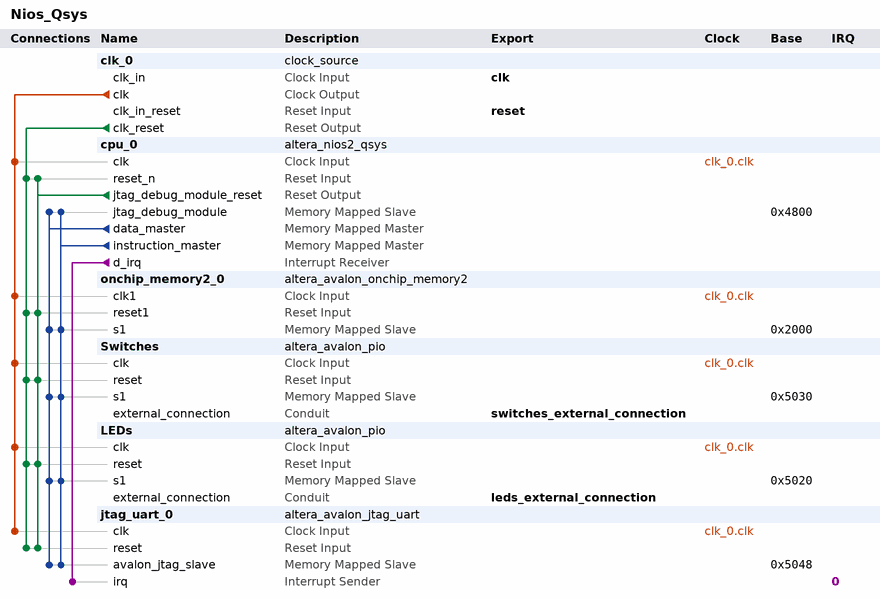
[diagram p0: system contents]
# Platform Designer (Qsys) system Nios_Qsys, Cyclone II EP2C35F672C6
# Parameters at their usual value, and those the tool derives, are not listed.
package require -exact qsys 13.0.1.99.2
create_system Nios_Qsys
set_project_property DEVICE_FAMILY {Cyclone II}
set_project_property DEVICE EP2C35F672C6

add_instance clk_0 clock_source 13.0
set_instance_parameter_value clk_0 clockFrequency 50000000

add_instance cpu_0 altera_nios2_qsys 13.0
set_instance_parameter_value cpu_0 resetSlave onchip_memory2_0.s1
set_instance_parameter_value cpu_0 mmu_TLBMissExcSlave None
set_instance_parameter_value cpu_0 exceptionSlave onchip_memory2_0.s1
set_instance_parameter_value cpu_0 breakSlave cpu_0.jtag_debug_module
set_instance_parameter_value cpu_0 impl Tiny
set_instance_parameter_value cpu_0 icache_size 4096

add_instance onchip_memory2_0 altera_avalon_onchip_memory2 13.0.1.99.2
set_instance_parameter_value onchip_memory2_0 dataWidth 32
set_instance_parameter_value onchip_memory2_0 dualPort false
set_instance_parameter_value onchip_memory2_0 initMemContent true
set_instance_parameter_value onchip_memory2_0 initializationFileName onchip_mem.hex
set_instance_parameter_value onchip_memory2_0 memorySize 8192

add_instance Switches altera_avalon_pio 13.0.1.99.2
set_instance_parameter_value Switches direction Input
set_instance_parameter_value Switches width 18

add_instance LEDs altera_avalon_pio 13.0.1.99.2
set_instance_parameter_value LEDs direction Output
set_instance_parameter_value LEDs width 18

add_instance jtag_uart_0 altera_avalon_jtag_uart 13.0.1.99.2
set_instance_parameter_value jtag_uart_0 simInteractiveOptions NO_INTERACTIVE_WINDOWS

# connections
add_connection clk_0.clk cpu_0.clk clock
add_connection clk_0.clk jtag_uart_0.clk clock
add_connection clk_0.clk LEDs.clk clock
add_connection clk_0.clk onchip_memory2_0.clk1 clock
add_connection clk_0.clk Switches.clk clock
add_connection clk_0.clk_reset cpu_0.reset_n reset
add_connection clk_0.clk_reset jtag_uart_0.reset reset
add_connection clk_0.clk_reset LEDs.reset reset
add_connection clk_0.clk_reset onchip_memory2_0.reset1 reset
add_connection clk_0.clk_reset Switches.reset reset
add_connection cpu_0.jtag_debug_module_reset cpu_0.reset_n reset
add_connection cpu_0.jtag_debug_module_reset jtag_uart_0.reset reset
add_connection cpu_0.jtag_debug_module_reset LEDs.reset reset
add_connection cpu_0.jtag_debug_module_reset onchip_memory2_0.reset1 reset
add_connection cpu_0.jtag_debug_module_reset Switches.reset reset
add_connection cpu_0.data_master cpu_0.jtag_debug_module avalon
set_connection_parameter_value cpu_0.data_master/cpu_0.jtag_debug_module baseAddress 0x4800
add_connection cpu_0.data_master jtag_uart_0.avalon_jtag_slave avalon
set_connection_parameter_value cpu_0.data_master/jtag_uart_0.avalon_jtag_slave baseAddress 0x5048
add_connection cpu_0.data_master LEDs.s1 avalon
set_connection_parameter_value cpu_0.data_master/LEDs.s1 baseAddress 0x5020
add_connection cpu_0.data_master onchip_memory2_0.s1 avalon
set_connection_parameter_value cpu_0.data_master/onchip_memory2_0.s1 baseAddress 0x2000
add_connection cpu_0.data_master Switches.s1 avalon
set_connection_parameter_value cpu_0.data_master/Switches.s1 baseAddress 0x5030
add_connection cpu_0.instruction_master cpu_0.jtag_debug_module avalon
set_connection_parameter_value cpu_0.instruction_master/cpu_0.jtag_debug_module baseAddress 0x4800
add_connection cpu_0.instruction_master jtag_uart_0.avalon_jtag_slave avalon
set_connection_parameter_value cpu_0.instruction_master/jtag_uart_0.avalon_jtag_slave baseAddress 0x5048
add_connection cpu_0.instruction_master LEDs.s1 avalon
set_connection_parameter_value cpu_0.instruction_master/LEDs.s1 baseAddress 0x5020
add_connection cpu_0.instruction_master onchip_memory2_0.s1 avalon
set_connection_parameter_value cpu_0.instruction_master/onchip_memory2_0.s1 baseAddress 0x2000
add_connection cpu_0.instruction_master Switches.s1 avalon
set_connection_parameter_value cpu_0.instruction_master/Switches.s1 baseAddress 0x5030
add_connection cpu_0.d_irq jtag_uart_0.irq interrupt
set_connection_parameter_value cpu_0.d_irq/jtag_uart_0.irq irqNumber 0

# exported interfaces
add_interface clk clock sink
set_interface_property clk EXPORT_OF clk_0.clk_in
add_interface switches_external_connection conduit end
set_interface_property switches_external_connection EXPORT_OF Switches.external_connection
add_interface leds_external_connection conduit end
set_interface_property leds_external_connection EXPORT_OF LEDs.external_connection
add_interface reset reset sink
set_interface_property reset EXPORT_OF clk_0.clk_in_reset

set_interconnect_requirement {$system} qsys_mm.clockCrossingAdapter HANDSHAKE
set_interconnect_requirement {$system} qsys_mm.maxAdditionalLatency 1

save_system Nios_Qsys.qsys
